# Altium schematic sheet main.SchDoc
size A4
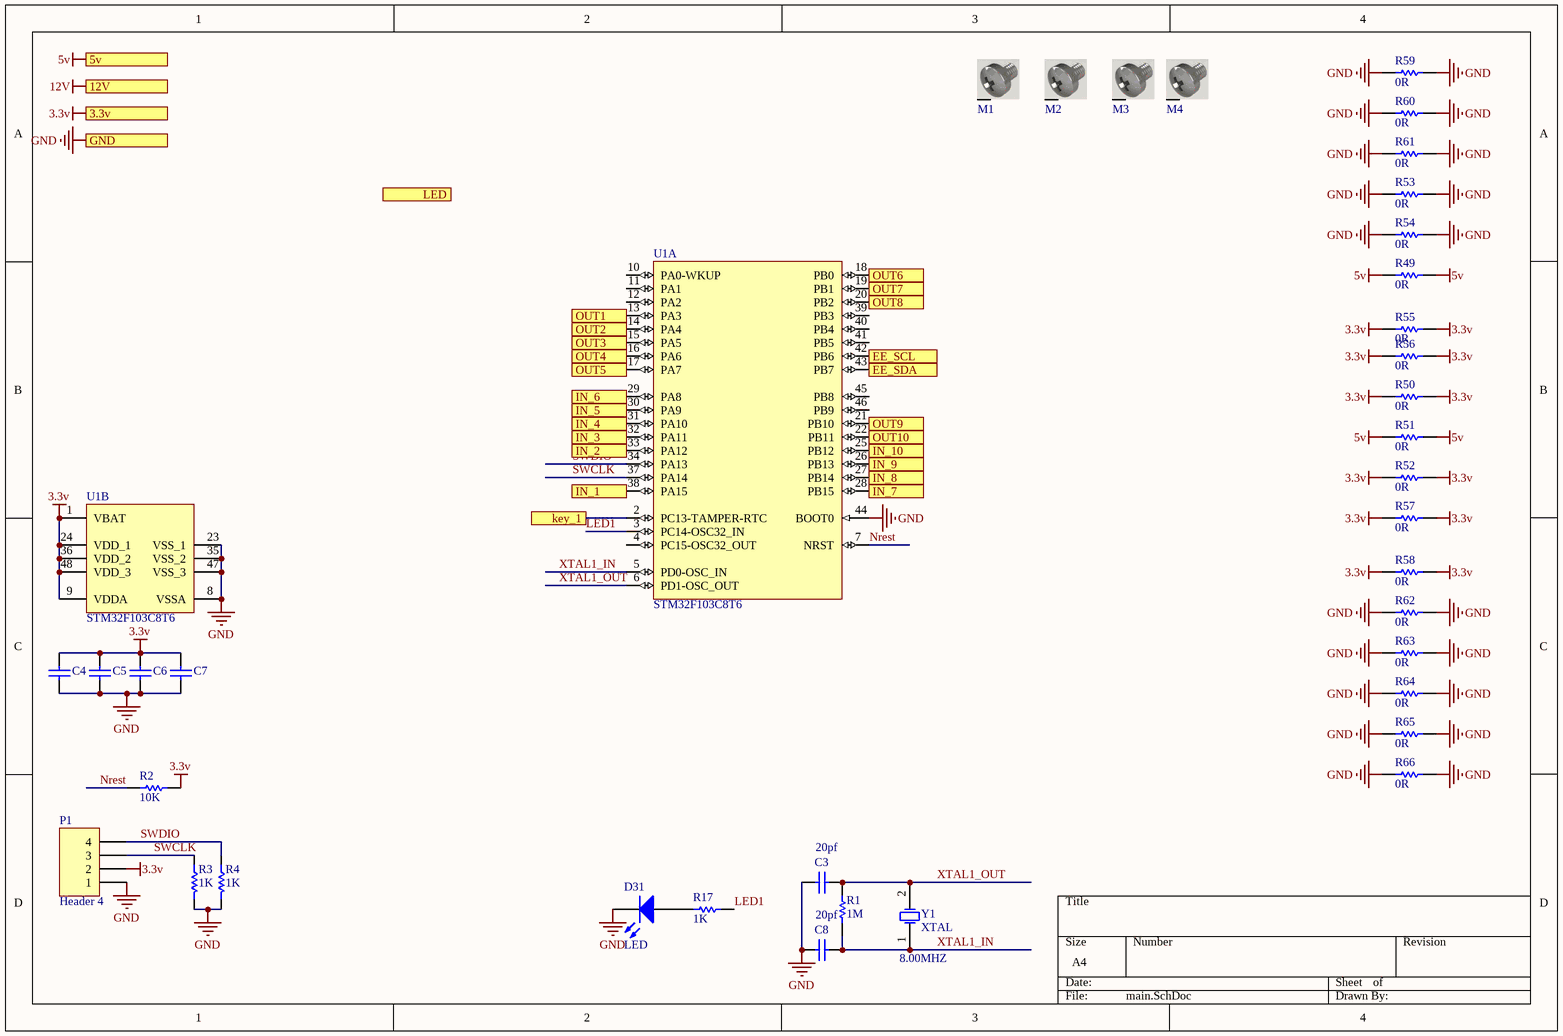
[diagram p0: main.SchDoc]

## Parts
C3  value 20pf  [RES 0805 (2012X06L)]
C4  (no value)  [RES 0805 (2012X06L)]
C5  (no value)  [RES 0805 (2012X06L)]
C6  (no value)  [RES 0805 (2012X06L)]
C7  (no value)  [RES 0805 (2012X06L)]
C8  value 20pf  [RES 0805 (2012X06L)]
D31  LED  [led 5mm]
M1  Screw  [Board Screw]  (value not drawn)
M2  Screw  [Board Screw]  (value not drawn)
M3  Screw  [Board Screw]  (value not drawn)
M4  Screw  [Board Screw]  (value not drawn)
P1  Header 4  [HDR1X4]
R1  value 1M  [RES 0805 (2012X06L)]  (hidden comment: Res1)
R2  valv: 10K  [RES 0805 (2012X06L)]
R3  1K  [RES 0805 (2012X06L)]
R4  1K  [RES 0805 (2012X06L)]
R17  value 1K  [RES 0805 (2012X06L)]  (hidden comment: resistor)
R49  value 0R  [RES 0805 optional]  (hidden comment: resistor)
R50  value 0R  [RES 0805 optional]  (hidden comment: resistor)
R51  value 0R  [RES 0805 optional]  (hidden comment: resistor)
R52  value 0R  [RES 0805 optional]  (hidden comment: resistor)
R53  value 0R  [RES 0805 optional]  (hidden comment: resistor)
R54  value 0R  [RES 0805 optional]  (hidden comment: resistor)
R55  value 0R  [RES 0805 optional]  (hidden comment: resistor)
R56  value 0R  [RES 0805 optional]  (hidden comment: resistor)
R57  value 0R  [RES 0805 optional]  (hidden comment: resistor)
R58  value 0R  [RES 0805 optional]  (hidden comment: resistor)
R59  value 0R  [RES 0805 optional]  (hidden comment: resistor)
R60  value 0R  [RES 0805 optional]  (hidden comment: resistor)
R61  value 0R  [RES 0805 optional]  (hidden comment: resistor)
R62  value 0R  [RES 0805 optional]  (hidden comment: resistor)
R63  value 0R  [RES 0805 optional]  (hidden comment: resistor)
R64  value 0R  [RES 0805 optional]  (hidden comment: resistor)
R65  value 0R  [RES 0805 optional]  (hidden comment: resistor)
R66  value 0R  [RES 0805 optional]  (hidden comment: resistor)
U1  STM32F103C8T6  [STM-LQFP48_N]  (parts A,B of 2)
Y1  XTAL  [Xtal]

## Ports
3.3v, 5v, 12V, EE_SCL, EE_SDA, GND, IN_1 (in), IN_2 (in), IN_3 (in), IN_4 (in), IN_5 (in), IN_6 (in), IN_7 (in), IN_8 (in), IN_9 (in), IN_10 (in), key_1, LED, OUT1 (out), OUT2 (out), OUT3 (out), OUT4 (out), OUT5 (out), OUT6 (out), OUT7 (out), OUT8 (out), OUT9 (out), OUT10 (out)

## Nets
3.3v: C4.2 C5.2 C6.2 C7.2 P1.2 R2.2 R50.1 R50.2 R52.1 R52.2 R55.1 R55.2 R56.1 R56.2 R57.1 R57.2 R58.1 R58.2 U1.1(VBAT) U1.9(VDDA) U1.24(VDD_1) U1.36(VDD_2) U1.48(VDD_3) ; port 3.3v
5v: R49.1 R49.2 R51.1 R51.2 ; port 5v
12V: port 12V
GND: C3.2 C4.1 C5.1 C6.1 C7.1 C8.2 D31.2(K) P1.1 R3.2 R4.2 R53.1 R53.2 R54.1 R54.2 R59.1 R59.2 R60.1 R60.2 R61.1 R61.2 R62.1 R62.2 R63.1 R63.2 R64.1 R64.2 R65.1 R65.2 R66.1 R66.2 U1.8(VSSA) U1.23(VSS_1) U1.35(VSS_2) U1.44(BOOT0) U1.47(VSS_3) ; port GND
EE_SCL: U1.42(PB6) ; port EE_SCL
EE_SDA: U1.43(PB7) ; port EE_SDA
IN_1: U1.38(PA15) ; port IN_1
IN_2: U1.33(PA12) ; port IN_2
IN_3: U1.32(PA11) ; port IN_3
IN_4: U1.31(PA10) ; port IN_4
IN_5: U1.30(PA9) ; port IN_5
IN_6: U1.29(PA8) ; port IN_6
IN_7: U1.28(PB15) ; port IN_7
IN_8: U1.27(PB14) ; port IN_8
IN_9: U1.26(PB13) ; port IN_9
IN_10: U1.25(PB12) ; port IN_10
key_1: U1.2(PC13-TAMPER-RTC) ; port key_1
LED1: R17.2 U1.3(PC14-OSC32_IN)
Nrest: R2.1 U1.7(NRST)
OUT1: U1.13(PA3) ; port OUT1
OUT2: U1.14(PA4) ; port OUT2
OUT3: U1.15(PA5) ; port OUT3
OUT4: U1.16(PA6) ; port OUT4
OUT5: U1.17(PA7) ; port OUT5
OUT6: U1.18(PB0) ; port OUT6
OUT7: U1.19(PB1) ; port OUT7
OUT8: U1.20(PB2) ; port OUT8
OUT9: U1.21(PB10) ; port OUT9
OUT10: U1.22(PB11) ; port OUT10
SWCLK: P1.3 R3.1 U1.37(PA14)
SWDIO: P1.4 R4.1 U1.34(PA13)
XTAL1_IN: C8.1 R1.1 U1.5(PD0-OSC_IN) Y1.1(OSC1)
XTAL1_OUT: C3.1 R1.2 U1.6(PD1-OSC_OUT) Y1.2(OSC2)
NetD31_1: D31.1(A) R17.1

Not connected (* = marked no-connect by the designer): M1 S; M2 S; M3 S; M4 S; U1 4(PC15-OSC32_OUT) 10(PA0-WKUP) 11(PA1) 12(PA2) 39(PB3) 40(PB4) 41(PB5) 45(PB8) 46(PB9)

## Notes on the sheet
- (in symbol XTAL) 8.00MHZ

## Library data of the parts
C3-C8 = Cap: Capacitor; Published: 8-Jun-2000; LatestRevisionDate: 17-Jul-2002; LatestRevisionNote: Re-released for DXP Platform.; PackageReference: RAD-0.3; Publisher: Altium Limited
M1-M4 = Pich: Board Screw With Spacer
P1 = Header 4: Header, 4-Pin; LatestRevisionDate: 17-Jul-2002; LatestRevisionNote: Re-released for DXP Platform.; Publisher: Altium Limited
R1 = Res1: Resistor; Published: 8-Jun-2000; LatestRevisionDate: 17-Jul-2002; LatestRevisionNote: Re-released for DXP Platform.; PackageReference: AXIAL-0.3; Publisher: Altium Limited
R2 = resistor
R3 R4 = Resistor: Tolerance: 5%; Power: 1/8 W; Value: 1K
U1 = STM32F103C8T6: ARM Cortex-M3 32-bit MCU, 64 KB Flash, 20 KB Internal RAM, 37 I/Os, 48-pin LQFP, -40 to 85 degC, Tray; A/D Converter: 2x12-bit (10 Channel); FLASH Size (Prog) (kB): 64; I/Os (High Current): 37; Internal RAM Size (kB): 20; Operating Frequency(F) (Processor speed) (MHz): 72; Supply Voltage(Vcc) min (V): 2; DatasheetVersion: Rev. 16; PackageVersion: Rev. 6, 06/2013; PackageReference: LQFP48; PackageDescription: 48-Pin Low Profile Quad Flat Package, 7 x 7 mm Body, 0.5 mm Pitch; Supplier 1: Digi-Key; Supplier Part Number 1: 497-6063-ND; Supplier 2: Farnell; Supplier Part Number 2: 1447637; Supplier 3: Newark; Supplier Part Number 3: 59M2182; Supplier 4: Newark; Supplier Part Number 4: 57P1222; Supplier 5: Mouser; Supplier Part Number 5: 511-STM32F103C8T6; Core: ARM Cortex-M3; Packing: Tray; Mounting Technology: Surface Mount; PartNumber: STM32F103C8T6; ComponentLink1Description: Manufacturer URL; ComponentLink1URL: http://www.st.com/web/en/home.html; ComponentLink2Description: Datasheet; ComponentLink2URL: http://www.st.com/st-web-ui/static/active/en/resource/technical/document/datasheet/CD00161566.pdf; ComponentLink3Description: Package Specification; ComponentLink3URL: http://www.st.com/st-web-ui/static/active/en/resource/technical/document/datasheet/DM00058181.pdf